# EAGLE design LoRa_Sensor_RevB (EAGLE 9.6.2)

## Sheet 1 of 2

## Sheet 2 of 2
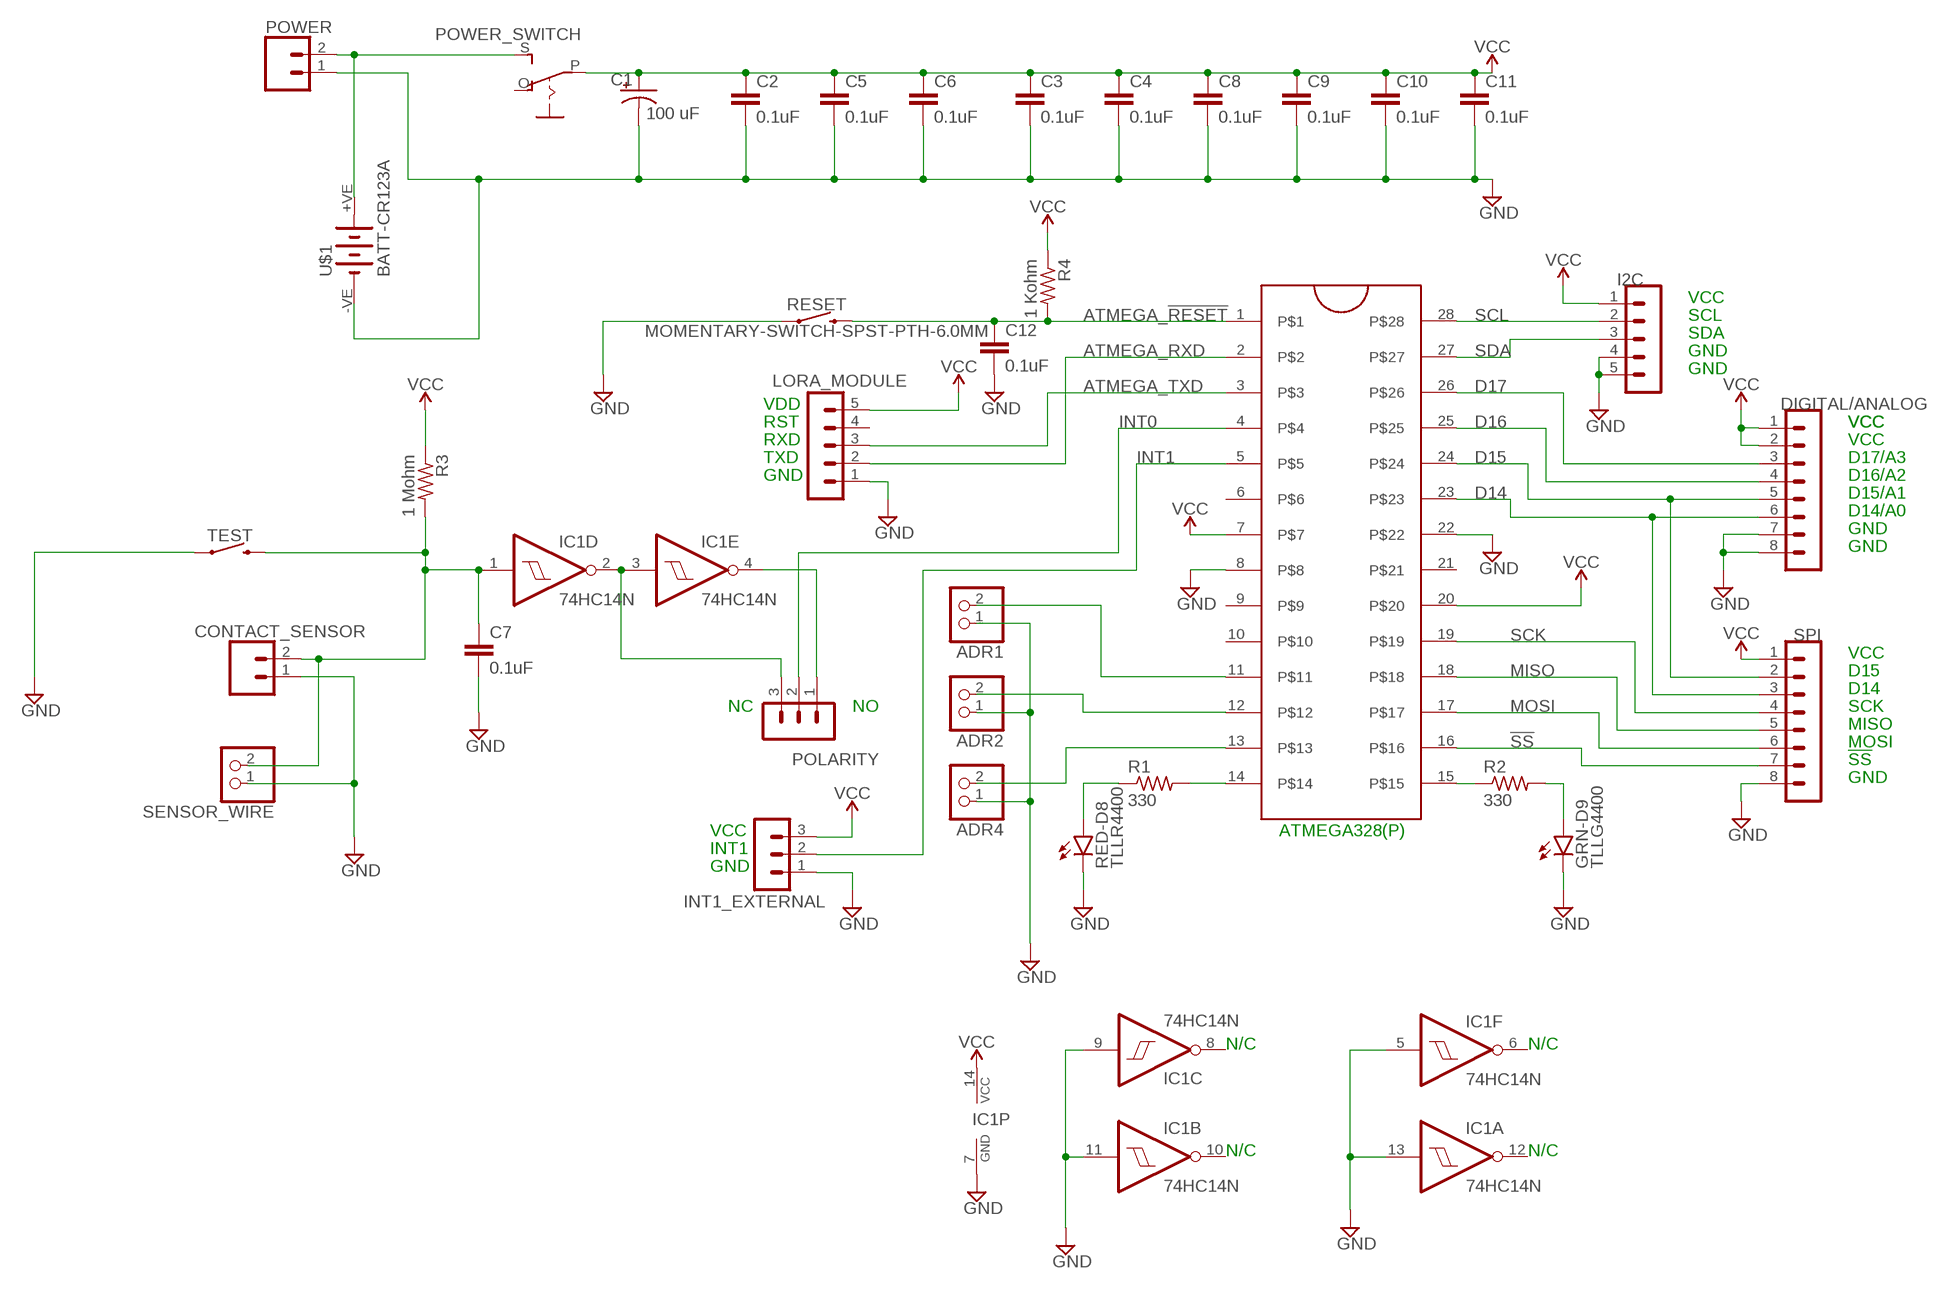
[diagram p0: schematic, sheet 2]

### Parts
ADR1  PINHD-1X2  [1X02]
ADR2  PINHD-1X2  [1X02]
ADR4  PINHD-1X2  [1X02]
C1  100 uF  CPOL-USE2.5-6  [E2,5-6]
C2  0.1uF  0.1UF-KIT-EZ-50V-20%  [CAP-PTH-SMALL-KIT]
C3  0.1uF  0.1UF-KIT-EZ-50V-20%  [CAP-PTH-SMALL-KIT]
C4  0.1uF  0.1UF-KIT-EZ-50V-20%  [CAP-PTH-SMALL-KIT]
C5  0.1uF  0.1UF-KIT-EZ-50V-20%  [CAP-PTH-SMALL-KIT]
C6  0.1uF  0.1UF-KIT-EZ-50V-20%  [CAP-PTH-SMALL-KIT]
C7  0.1uF  0.1UF-KIT-EZ-50V-20%  [CAP-PTH-SMALL-KIT]
C8  0.1uF  0.1UF-KIT-EZ-50V-20%  [CAP-PTH-SMALL-KIT]
C9  0.1uF  0.1UF-KIT-EZ-50V-20%  [CAP-PTH-SMALL-KIT]
C10  0.1uF  0.1UF-KIT-EZ-50V-20%  [CAP-PTH-SMALL-KIT]
C11  0.1uF  0.1UF-KIT-EZ-50V-20%  [CAP-PTH-SMALL-KIT]
C12  0.1uF  0.1UF-KIT-EZ-50V-20%  [CAP-PTH-SMALL-KIT]
CONTACT_SENSOR  CONN_023.5MM  [SCREWTERMINAL-3.5MM-2]
DIGITAL/ANALOG  MA08-1  [MA08-1]
GRN-D9  TLLG4400  [LED3MM]
I2C  MA05-1  [MA05-1]
IC1  74HC14N  [DIL14]
INT1_EXTERNAL  MA03-1  [MA03-1]
J1  ZIFSOCKET-28-3"  [DIL28-3-ZIF_SOCKET]
LORA_MODULE  MA05-1  [MA05-1]
POLARITY  MA03-1  [MA03-1]
POWER  CONN_023.5MM  [SCREWTERMINAL-3.5MM-2]
POWER_SWITCH  EG1218S  [EG1218]
R1  330  R-US_0309/12  [0309/12]
R2  330  R-US_0309/12  [0309/12]
R3  1 Mohm  R-US_0309/12  [0309/12]
R4  1 Kohm  R-US_0309/12  [0309/12]
RED-D8  TLLR4400  [LED3MM]
RESET  MOMENTARY-SWITCH-SPST-PTH-6.0MM  [TACTILE_SWITCH_PTH_6.0MM]
SENSOR_WIRE  PINHD-1X2  [1X02]
SPI  MA08-1  [MA08-1]
TEST  MOMENTARY-SWITCH-SPST-PTH-6.0MM  [TACTILE_SWITCH_PTH_6.0MM]
U$1  BATT-CR123A  [KEYSTONE-2/3A]

### Nets
!SS: J1.16 SPI.7
ATMEGA_!RESET: C12.1 J1.1 R4.2 RESET.3
ATMEGA_RXD: J1.2 LORA_MODULE.2
ATMEGA_TXD: J1.3 LORA_MODULE.3
D14: DIGITAL/ANALOG.6 J1.23 SPI.3
D15: DIGITAL/ANALOG.5 J1.24 SPI.2
D16: DIGITAL/ANALOG.4 J1.25
D17: DIGITAL/ANALOG.3 J1.26
GND: ADR1.1 ADR2.1 ADR4.1 C1.- C2.2 C3.2 C4.2 C5.2 C6.2 C7.2 C8.2 C9.2 C10.2 C11.2 C12.2 CONTACT_SENSOR.1 DIGITAL/ANALOG.7 DIGITAL/ANALOG.8 GRN-D9.K(C) I2C.4 I2C.5 IC1.5(F:I) IC1.7(P:GND) IC1.9(C:I) IC1.11(B:I) IC1.13(A:I) INT1_EXTERNAL.1 J1.8 J1.22 LORA_MODULE.1 POWER.1 RED-D8.K(C) RESET.1 SENSOR_WIRE.1 SPI.8 TEST.1 U$1.-VE(-)
INT0: J1.4 POLARITY.2
INT1: INT1_EXTERNAL.2 J1.5
MISO: J1.18 SPI.5
MOSI: J1.17 SPI.6
N$1: C7.1 CONTACT_SENSOR.2 IC1.1(D:I) R3.2 SENSOR_WIRE.2 TEST.3
N$2: POWER.2 POWER_SWITCH.S U$1.+VE(+)
N$3: J1.15 R2.1
N$4: GRN-D9.A R2.2
N$5: J1.14 R1.2
N$6: R1.1 RED-D8.A
N$7: ADR4.2 J1.13
N$8: IC1.2(D:O) IC1.3(E:I) POLARITY.3
N$9: IC1.4(E:O) POLARITY.1
N$10: ADR2.2 J1.12
N$11: ADR1.2 J1.11
SCK: J1.19 SPI.4
SCL: I2C.2 J1.28
SDA: I2C.3 J1.27
VCC: C1.+ C2.1 C3.1 C4.1 C5.1 C6.1 C8.1 C9.1 C10.1 C11.1 DIGITAL/ANALOG.1 DIGITAL/ANALOG.2 I2C.1 IC1.14(P:VCC) INT1_EXTERNAL.3 J1.7 J1.20 LORA_MODULE.5 POWER_SWITCH.P R3.1 R4.1 SPI.1
Unconnected: IC1.6(F:O) IC1.8(C:O) IC1.10(B:O) IC1.12(A:O) J1.6 J1.9 J1.10 J1.21 LORA_MODULE.4 POWER_SWITCH.O

### Notes on the sheet
- VCC
- SCL
- SDA
- GND
- GND
- VDD
- RST | VCC | VCC
- RXD | VCC
- TXD | D17/A3
- GND | D16/A2
- D15/A1
- D14/A0
- GND
- GND
- VCC
- D15
- D14
- NC | NO | SCK
- MISO
- MOSI
- !SS
- GND
- VCC | ATMEGA328(P)
- INT1
- GND
- N/C | N/C
- N/C | N/C

## Library data of the parts
ADR1 ADR2 ADR4 SENSOR_WIRE = pinhead:PINHD-1X2: PIN HEADER
C1 = adafruit:CPOL-US: POLARIZED CAPACITOR, American symbol
C2-C12 = SparkFun-Capacitors:0.1UF: 0.1µF ceramic capacitors A capacitor is a passive two-terminal electrical component used to store electrical energy temporarily in an electric field.; PROD_ID: CAP-08370
CONTACT_SENSOR POWER = SparkFun-Connectors:CONN_02: Multi connection point. Often used as Generic Header-pin footprint for 0.1 inch spaced/style header connections On any of the 0.1 inch spaced packages, you can populate with these: Break Away Headers - Straight <https://www.sparkfun.com/products/116> (PRT-00116) Break Away Male Headers - Right Angle <https://www.sparkfun.com/products/553> (PRT-00553) Female Headers <https://www.sparkfun.com/products/115> (PRT-00115) Break Away Headers - Machine Pin <https://www.sparkfun.com/products/117> (PRT-00117) Break Away Female Headers - Swiss Machine Pin <https://www.sparkfun.com/products/743> (PRT-00743) For SCREWTERMINALS and SPRING TERMINALS visit here: Screw Terimnals on SparkFun.com <https://www.sparkfun.com/search/results?term=Screw+Terminals> (5mm/3.5mm/2.54mm spacing) This device is also useful as a general connection point to wire up your design to another part of your project. Our various solder wires solder well into these plated through hole pads. Hook-Up Wire - Assortment (Stranded, 22 AWG) <https://www.sparkfun.com/products/11375> (PRT-11375) Hook-Up Wire - Assortment (Solid Core, 22 AWG) <https://www.sparkfun.com/products/11367> (PRT-11367) View the entire wire category on our website here <https://www.sparkfun.com/categories/141> Special notes: Molex polarized connector foot print use with: PRT-08233 with associated crimp pins and housings. 2.54_SCREWTERM for use with PRT-10571. 3.5mm Screw Terminal footprints for PRT-08084 5mm Screw Terminal footprints for use with PRT-08432; PROD_ID: CONN-08399
DIGITAL/ANALOG SPI = con-lstb:MA08-1: PIN HEADER; OC_FARNELL: unknown; OC_NEWARK: unknown
GRN-D9 = led:TLLG4400: Low Current (2mA) LED 3 mm Tinted Diffused Package color GREEN Source: Data sheet <http://www.farnell.com/datasheets/391098.pdf>; MF: VISHAY SEMICONDUCTOR; OC_FARNELL: 1612435
I2C LORA_MODULE = con-lstb:MA05-1: PIN HEADER; OC_FARNELL: unknown; OC_NEWARK: unknown
IC1 = 74xx-eu:74*14: Hex schmitt trigger INVERTER
INT1_EXTERNAL POLARITY = con-lstb:MA03-1: PIN HEADER; OC_FARNELL: unknown; OC_NEWARK: unknown
J1 = SparkFun-Connectors:ZIFSOCKET-28-3: ZIF Socket 28-Pin 0.3" Lever-action ZIF socket for 28-pin ICs SparkFun Products: ZIF Socket 28-Pin <https://www.sparkfun.com/products/9175>; PROD_ID: CONN-10960; SF_ID: PRT-09175
POWER_SWITCH = adafruit:EG1218: SLIDING SWITCH 0.1" spacing through hole, vertical SPDT slide switch http://www.ladyada.net/library/pcb/eaglelibrary.html
R1-R4 = adafruit:R-US_: RESISTOR, American symbol
RED-D8 = led:TLLR4400: Low Current (2mA) LED 3 mm Tinted Diffused Package color RED Source: Data sheet <http://www.farnell.com/datasheets/391100.pdf>; MF: VISHAY SEMICONDUCTOR; OC_FARNELL: 1612437
RESET TEST = SparkFun-Switches:MOMENTARY-SWITCH-SPST: Momentary Switch (Pushbutton) - SPST Normally-open (NO) SPST momentary switches (buttons, pushbuttons). Variants PTH-12MM - 12mm square, through-hole Momentary Pushbutton Switch - 12mm Square <https://www.sparkfun.com/products/9190> (COM-09190) PTH-6.0MM, PTH-6.0MM-KIT - 6.0mm square, through-hole Mini Pushbutton Switch <https://www.sparkfun.com/products/97> (COM-00097) KIT package intended for soldering kit's - only one side of pads' copper is exposed. PTH-RIGHT-ANGLE-KIT - Right-angle, through-hole Right Angle Tactile Button <https://www.sparkfun.com/products/10791> - Used on SparkFun BigTime Watch Kit <https://www.sparkfun.com/products/11734> SMD-12MM - 12mm square, surface-mount Tactile Button - SMD (12mm) <https://www.sparkfun.com/products/12993> (COM-12993) Used on SparkFun PicoBoard <https://www.sparkfun.com/products/11888> SMD-4.5MM - 4.5mm Square Trackball Switch Used on SparkFun Blackberry Trackballer Breakout <https://www.sparkfun.com/products/13169> SMD-4.6MMX2.8MM - 4.60mm x 2.80mm, surface mount Used on SparkFun SAMD21 Mini Breakout <https://www.sparkfun.com/products/13664> SMD-5.2MM, SMD-5.2-REDUNDANT - 5.2mm square, surface-mount Mini Pushbutton Switch - SMD <https://www.sparkfun.com/products/8720> (COM-08720) Used on Arduino Pro Mini <https://www.sparkfun.com/products/11114> REDUNDANT package connects both switch circuits together SMD-6.0X3.5MM - 6.0 x 3.5mm, surface mount Momentary Reset Switch SMD <https://www.sparkfun.com/products/8229> (COM-08229) SMD-6.2MM-TALL - 6.2mm square, surface mount Tactile Button - SMD (6mm) <https://www.sparkfun.com/products/12992> Used on SparkFun Digital Sandbox <https://www.sparkfun.com/products/12651> SMD-RIGHT-ANGLE - Right-angle, surface mount Used on SparkFun Block for Intel® Edison - Arduino <https://www.sparkfun.com/products/13036>; PROD_ID: SWCH-08441; SF_SKU: COM-00097
U$1 = eagle-library-edeca.net-v5:BATT-CR123A: CR123A (2/3rd AA) battery holder Manufacturer: Keystone Mouser part: 534-1019

## Board
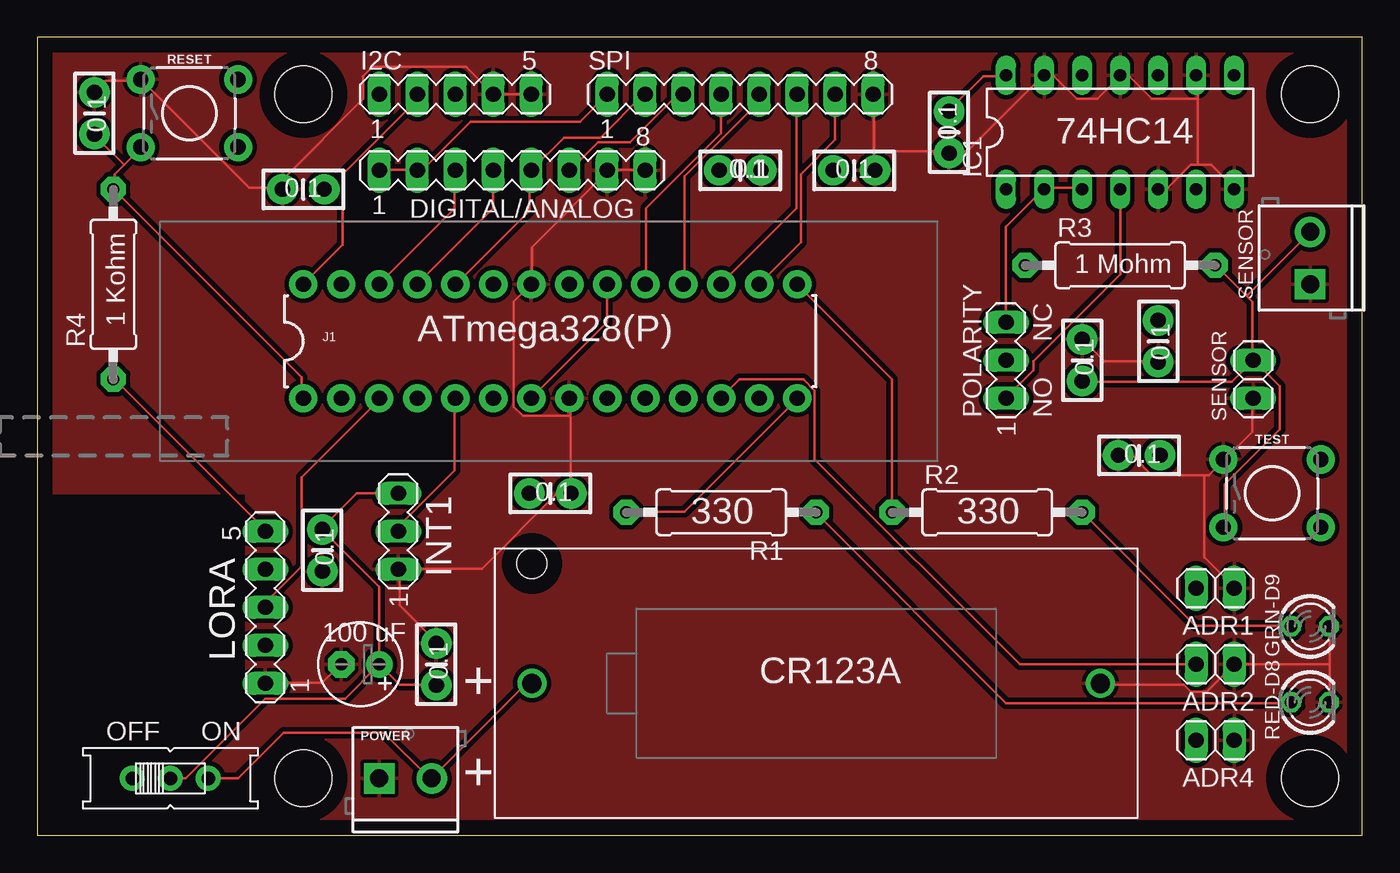
[diagram p1: board, top side]
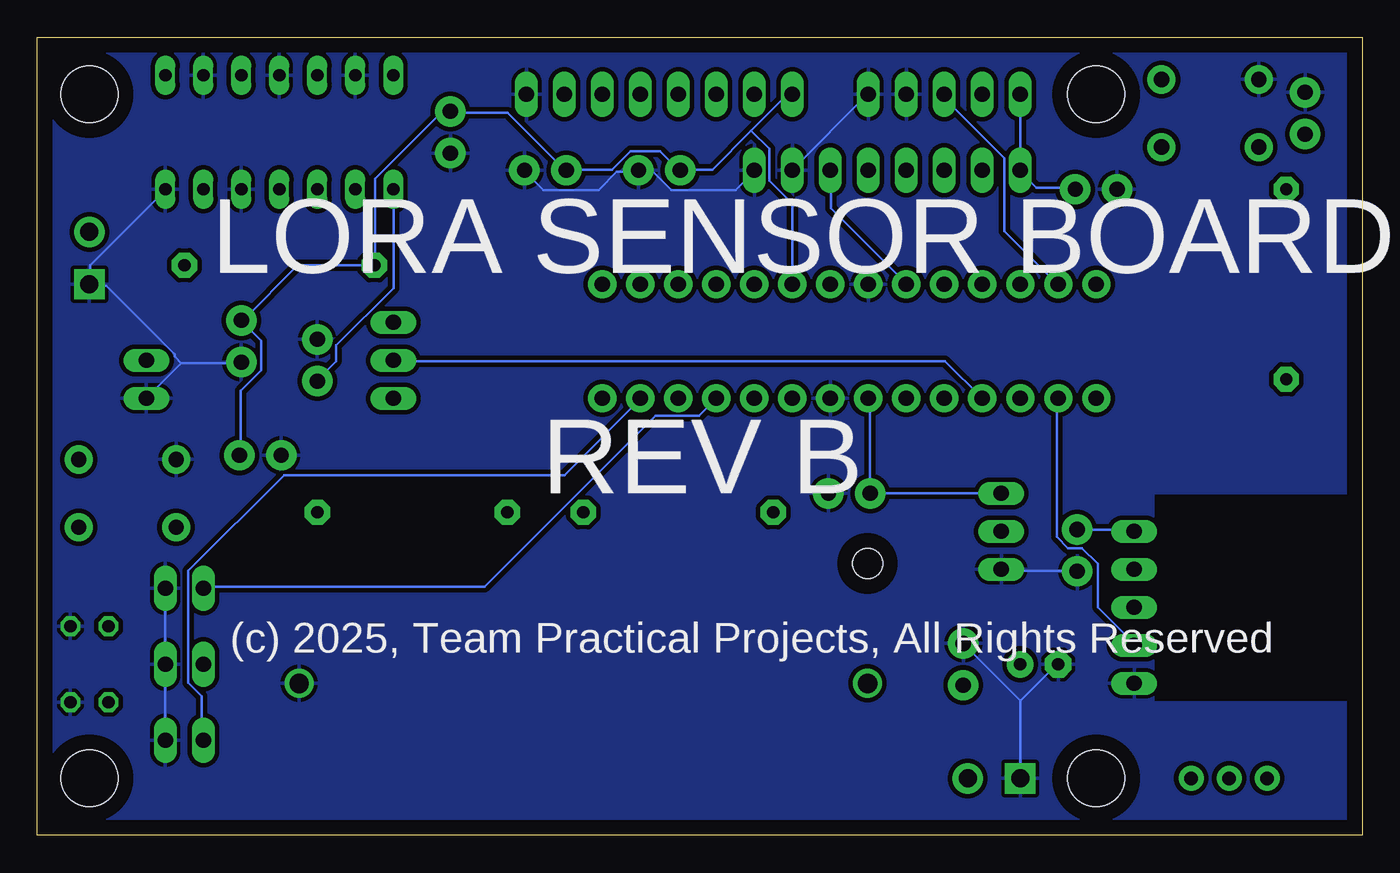
[diagram p2: board, bottom side, seen from below]

Size 88.57 x 53.33 mm. Coordinates in mm from the lower left corner, seen from the top.
Outline: 0,0 88.57,0 88.57,53.33 0,53.33 0,0
Copper layers (1*16): Top 0.035mm / dielectric 1.5mm / Bottom 0.035mm
Design rules "default": minimum track width 6mil, minimum drill 0.35mm, track to track 6mil, track to pad 6mil, pad to pad 6mil, via to via 6mil, smd to smd 6mil, copper to edge 40mil, drill to drill 6mil, minimum pad ring 10mil, minimum via ring 8mil, stop-mask expansion 4mil, vias tented up to drill 0mil, thermal gap 10mil
Holes 3.8 mm at 85.09,3.81 85.09,49.53 17.78,3.81 17.78,49.53
tKeepout: area 0,8.9 to 14,22.9
bKeepout: area 0,8.9 to 14,22.9

### Footprints (pad centres in the part's own frame; a part is rotated, then mirrored left to right if it is on the bottom)
1X02 = drill 1.016 long: 1 -1.27,0; 2 1.27,0
E2,5-6 = drill 0.813 pad 1.778: + -1.27,0 | drill 0.813 pad 1.778 octagon: - 1.27,0
CAP-PTH-SMALL-KIT = drill 1.016 pad 2.032: 1 -1.397,0; 2 1.397,0
SCREWTERMINAL-3.5MM-2 = drill 1.2 pad 2.032 square: 1 0,0 | drill 1.2 pad 2.032: 2 3.5,0
MA08-1 = drill 1.016 long: 1 -8.89,0; 2 -6.35,0; 3 -3.81,0; 4 -1.27,0; 5 1.27,0; 6 3.81,0; 7 6.35,0; 8 8.89,0
LED3MM = drill 0.813 octagon: A -1.27,0; K 1.27,0
MA05-1 = drill 1.016 long: 1 -5.08,0; 2 -2.54,0; 3 0,0; 4 2.54,0; 5 5.08,0
DIL14 = drill 0.813 long: 1 -7.62,-3.81; 2 -5.08,-3.81; 3 -2.54,-3.81; 4 0,-3.81; 5 2.54,-3.81; 6 5.08,-3.81; 7 7.62,-3.81; 8 7.62,3.81; 9 5.08,3.81; 10 2.54,3.81; 11 0,3.81; 12 -2.54,3.81; 13 -5.08,3.81; 14 -7.62,3.81
MA03-1 = drill 1.016 long: 1 -2.54,0; 2 0,0; 3 2.54,0
DIL28-3-ZIF_SOCKET = drill 1.016 pad 1.88: 1 -16.51,-3.81; 2 -13.97,-3.81; 3 -11.43,-3.81; 4 -8.89,-3.81; 5 -6.35,-3.81; 6 -3.81,-3.81; 7 -1.27,-3.81; 8 1.27,-3.81; 9 3.81,-3.81; 10 6.35,-3.81; 11 8.89,-3.81; 12 11.43,-3.81; 13 13.97,-3.81; 14 16.51,-3.81; 15 16.51,3.81; 16 13.97,3.81; 17 11.43,3.81; 18 8.89,3.81; 19 6.35,3.81; 20 3.81,3.81; 21 1.27,3.81; 22 -1.27,3.81; 23 -3.81,3.81; 24 -6.35,3.81; 25 -8.89,3.81; 26 -11.43,3.81; 27 -13.97,3.81; 28 -16.51,3.81
EG1218 = drill 0.9 pad 1.676: O -2.54,0; P 0,0; S 2.54,0
0309/12 = drill 0.813 pad 1.676 octagon: 1 -6.35,0; 2 6.35,0
TACTILE_SWITCH_PTH_6.0MM = drill 1.016 pad 1.88: 1 -3.251,2.261; 2 3.251,2.261; 3 -3.251,-2.261; 4 3.251,-2.261
KEYSTONE-2/3A = drill 1.3: +VE 0,19; -VE 0,-19 | hole 2: 8,19

### Placement (x,y rotation side)
ADR1  78.74,16.51 180 top
ADR2  78.74,11.43 180 top
ADR4  78.74,6.35 180 top
C1  21.59,11.43 180 top
C2  73.66,25.4 180 top
C3  60.96,46.99 270 top
C4  54.61,44.45 0 top
C5  46.99,44.45 0 top
C6  26.67,11.43 90 top
C7  69.85,31.75 90 top
C8  34.29,22.86 0 top
C9  19.05,19.05 270 top
C10  74.93,33.02 270 top
C11  17.78,43.18 180 top
C12  3.81,48.26 90 top
CONTACT_SENSOR  85.09,36.83 90 top
DIGITAL/ANALOG  31.75,44.45 0 top
GRN-D9  85.09,13.97 0 top
I2C  27.94,49.53 0 top
IC1  72.39,46.99 0 top
INT1_EXTERNAL  24.13,20.32 90 top
J1  34.29,33.02 0 top
LORA_MODULE  15.24,15.24 90 top
POLARITY  64.77,31.75 90 top
POWER  22.86,3.81 0 top
POWER_SWITCH  8.89,3.81 0 top
R1  45.72,21.59 180 top
R2  63.5,21.59 0 top
R3  72.39,38.1 0 top
R4  5.08,36.83 90 top
RED-D8  85.09,8.89 0 top
RESET  10.16,48.26 0 top
SENSOR_WIRE  81.28,30.48 90 top
SPI  46.99,49.53 0 top
TEST  82.55,22.86 0 top
U$1  52.07,10.16 90 top

### Tracks (layer width: path | path; a pad name or v marks a point on that pad's centre or on a via)
!SS
  Top 0.152: SPI.7 53.34,46.48 51.05,44.2 51.05,39.62 J1.16
ATMEGA_!RESET
  Top 0.152: 5.79,44.81 6.86,45.87 RESET.3 | 5.79,44.81 5.18,44.2 5.18,43.28 R4.2 5.18,43.13 17.68,30.63 17.68,29.26 J1.1 | 5.79,44.81 3.81,46.79 C12.1
ATMEGA_RXD
  Bottom 0.152: LORA_MODULE.2 15.24,12.8 17.68,15.24 17.68,18.14 18.75,19.2 19.66,19.2 20.42,19.96 20.42,29.11 J1.2
ATMEGA_TXD
  Top 0.152: LORA_MODULE.3 15.24,15.54 17.68,17.98 17.68,23.93 22.86,29.11 J1.3
D14
  Top 0.152: SPI.3 42.82,49.53 39.62,46.33 37.49,46.33 35.66,44.5 DIGITAL/ANALOG.6
  Bottom 0.152: DIGITAL/ANALOG.6 35.51,44.35 35.51,41.91 30.48,36.88 J1.23
D15
  Top 0.152: J1.24 28.04,36.88 32.92,41.76 32.92,44.35 DIGITAL/ANALOG.5 35.2,46.63 37.64,46.63 40.54,49.53 SPI.2
D16
  Top 0.152: DIGITAL/ANALOG.4 30.48,41.91 J1.25
D17
  Top 0.152: DIGITAL/ANALOG.3 27.89,44.35 27.89,41.91 22.86,36.88 J1.26
GND
  Top 0.152: C10.2 74.83,31.7 71.32,31.7 69.95,33.07 C7.2 | SENSOR_WIRE.1 81.23,29.11 81.23,26.98 79.4,25.15 TEST.1 79.25,24.99 78.33,24.08 78.03,24.08 | 78.03,24.08 74.52,24.08 73.3,25.3 72.39,25.3 C2.2 | 86.41,11.43 86.41,13.87 GRN-D9.K | 86.41,11.43 86.41,8.99 RED-D8.K | U$1.-VE 71.17,10.06 76.66,10.06 77.11,9.6 78.18,9.6 ADR2.1 86.41,11.43 | 78.03,24.08 78.03,18.59 80.01,16.61 ADR1.1 | 55.93,45.72 55.93,44.5 C4.2 | 55.93,45.72 55.93,49.53 SPI.8 | 55.93,45.72 60.96,45.72 | 72.39,50.75 70.87,49.23 69.49,49.23 67.97,50.75 67.36,50.75 IC1.13 67.21,50.75 62.18,45.72 60.96,45.72 | 77.57,44.81 78.49,44.81 80.01,43.28 IC1.7 | 77.57,44.81 77.11,44.81 75.59,43.28 74.98,43.28 IC1.5 | 77.57,44.81 77.57,49.23 | 77.57,49.23 77.57,50.75 IC1.9 | 72.39,50.75 73,50.75 74.52,49.23 77.57,49.23 | 72.39,50.75 IC1.11 | 60.96,45.72 C3.2 | LORA_MODULE.1 15.24,10.21 19.05,10.21 20.27,11.43 C1.- | C6.2 26.67,12.95 24.23,15.39 24.23,17.68 INT1_EXTERNAL.1 24.23,17.83 29.72,17.83 34.75,22.86 35.66,22.86 | C12.2 3.81,49.68 4.57,50.44 6.86,50.44 RESET.1 7.01,50.44 14.17,43.28 16.31,43.28 C11.2 16.46,43.28 16.46,43.89 21.79,49.23 21.79,50.75 22.4,51.36 28.65,51.36 I2C.4 I2C.5 | 35.66,22.86 35.66,28.04 | 35.66,28.04 35.66,29.11 J1.8 | DIGITAL/ANALOG.8 40.54,44.5 38.1,44.5 DIGITAL/ANALOG.7 38.1,44.35 33.07,39.32 33.07,36.88 J1.22 31.85,35.66 31.85,28.65 32.46,28.04 35.66,28.04 | 35.66,22.86 C8.2
  Bottom 0.152: 78.94,31.55 74.98,31.55 C10.2 | SENSOR_WIRE.1 78.94,31.55 | ADR4.1 ADR2.1 ADR1.1 | C4.2 55.93,44.35 54.71,43.13 51.05,43.13 49.84,44.35 48.46,44.35 C5.2 48.31,44.35 47.4,44.35 46.18,43.13 41.91,43.13 40.69,44.35 DIGITAL/ANALOG.8 | IC1.7 80.01,43.13 85.04,38.1 85.04,36.88 CONTACT_SENSOR.1 85.04,36.73 83.97,36.73 79.4,32.16 79.4,32 78.94,31.55 | INT1_EXTERNAL.1 24.08,17.68 19.05,17.68 C9.2 | 22.86,8.99 POWER.1 | 22.86,8.99 20.42,11.43 C1.- | 22.86,8.99 26.67,12.8 C6.2 | I2C.5 33.07,49.53 38.1,44.5 DIGITAL/ANALOG.7
  pour Top (isolate 0.305): 0,0 0,8.89 13.97,8.89 13.97,22.86 0,22.86 0,53.34 88.9,53.34 88.9,0
  pour Bottom (isolate 0.305): 0,0 0,8.89 13.97,8.89 13.97,22.86 0,22.86 0,53.34 88.9,53.34 88.9,0
INT0
  Bottom 0.152: J1.4 27.89,31.7 64.77,31.7 POLARITY.2
INT1
  Top 0.152: INT1_EXTERNAL.2 24.23,20.42 24.23,20.73 27.89,24.38 27.89,29.11 J1.5
MISO
  Top 0.152: SPI.5 48.16,49.53 48.16,48.92 43.28,44.04 43.28,36.88 J1.18
MOSI
  Top 0.152: SPI.6 50.75,49.53 50.75,41.91 45.72,36.88 J1.17
N$1
  Top 0.152: 80.77,36.12 78.79,38.1 R3.2 | 80.77,36.12 81.23,35.66 81.23,31.85 SENSOR_WIRE.2 | TEST.3 79.4,20.73 79.4,23.47 83.06,27.13 83.06,30.02 81.38,31.7 SENSOR_WIRE.2 | 80.77,36.12 80.92,36.12 85.04,40.23 CONTACT_SENSOR.2 | SENSOR_WIRE.2 79.86,30.33 69.95,30.33 C7.1
  Bottom 0.152: IC1.1 64.77,36.58 68.58,32.77 68.58,31.7 69.8,30.48 C7.1
N$2
  Top 0.152: POWER_SWITCH.S 13.41,3.81 16.46,6.86 23.16,6.86 26.21,3.81 POWER.2 32.61,10.06 32.92,10.06 U$1.+VE
N$3
  Top 0.152: R2.1 57.15,30.48 J1.15
N$4
  Top 0.152: R2.2 77.42,14.02 83.82,14.02 GRN-D9.A
N$5
  Top 0.152: R1.2 39.47,21.64 43.28,21.64 50.75,29.11 J1.14
N$6
  Top 0.152: RED-D8.A 83.82,8.84 64.77,8.84 52.12,21.49 R1.1
N$7
  Bottom 0.152: ADR4.2 77.57,6.4 77.57,9.3 78.49,10.21 78.49,17.68 72.09,24.08 53.34,24.08 48.31,29.11 J1.13
N$8
  Top 0.152: IC1.3 69.8,43.28 67.36,43.28 IC1.2 67.21,43.13 64.77,40.69 POLARITY.3
N$9
  Top 0.152: IC1.4 72.39,37.49 66.6,31.7 66.6,31.09 64.77,29.26 POLARITY.1
N$10
  Top 0.152: ADR2.2 65.68,11.43 51.97,25.15 51.97,29.72 51.21,30.48 46.94,30.48 45.72,29.26 J1.12
N$11
  Bottom 0.152: J1.11 44.35,28.04 47.24,28.04 58.67,16.61 77.42,16.61 ADR1.2
SCK
  Top 0.152: SPI.4 45.72,46.94 40.69,41.91 40.69,36.88 J1.19
SCL
  Top 0.152: J1.28 20.42,39.47 20.42,44.2 25.3,49.07 25.3,49.53 I2C.2
SDA
  Bottom 0.152: I2C.3 27.89,49.53 27.89,49.23 23.93,45.26 23.93,40.39 20.42,36.88 J1.27
VCC
  Top 0.152: POWER_SWITCH.P 9.91,3.81 15.24,9.14 20.57,9.14 C1.+ | C1.+ 24.23,10.06 26.67,10.06 C6.1 | J1.20 38.1,34.29 J1.7 | INT1_EXTERNAL.3 21.34,22.86 19.05,20.57 C9.1 19.05,20.42 22.86,16.61 C1.+ | R4.1 5.18,30.48 15.24,20.42 LORA_MODULE.5 | DIGITAL/ANALOG.1 22.86,44.5 25.3,44.5 DIGITAL/ANALOG.2 25.45,44.5 25.76,44.5 28.96,47.7 36.27,47.7 SPI.1 | IC1.14 64.77,50.75 63.25,50.75 60.96,48.46 C3.1
  Bottom 0.152: J1.7 32.92,29.11 32.92,22.86 C8.1 INT1_EXTERNAL.3 | LORA_MODULE.5 15.24,20.42 19.05,20.42 C9.1 | C2.1 74.98,25.45 74.98,29.72 73.61,31.09 73.61,33.07 74.83,34.29 C10.1 74.83,34.44 71.17,38.1 R3.1 65.99,38.1 65.99,43.89 61.57,48.31 60.96,48.31 | I2C.1 DIGITAL/ANALOG.1 22.86,44.35 21.79,43.28 19.2,43.28 C11.1 | SPI.1 38.41,49.53 40.84,47.09 | 40.84,47.09 43.43,44.5 45.57,44.5 C5.1 45.72,44.5 46.94,45.72 48.92,45.72 50.14,44.5 53.19,44.5 C4.1 53.34,44.5 57.15,48.31 60.96,48.31 | 60.96,48.31 C3.1 | J1.20 38.1,42.22 39.62,43.74 39.62,45.87 40.84,47.09

### Text on the board
tPlace: 0.1 | 0.1 | 74HC14 | 0.1 | 0.1 | 0.1 | 0.1 | 1 Mohm | SENSOR | 1 Kohm | ATmega328(P) | NC | 0.1 | 0.1 | NO | SENSOR | 0.1 | 0.1 | 330 | 330 | 0.1 | INT1 | 100 uF | LORA | GRN-D9 | 0.1 | CR123A | + | OFF | ON | RED-D8 | +
bPlace: LORA SENSOR BOARD | REV B | (c) 2025, Team Practical Projects, All Rights Reserved